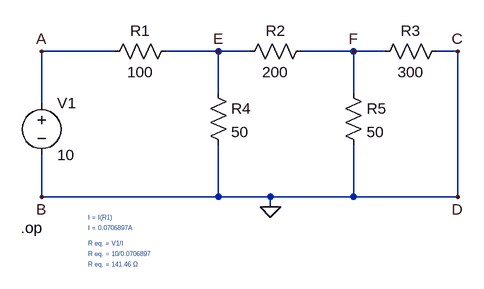
[diagram p0: schematic Eq_R_part1.asc]
Eq_R_part1.asc, the LTspice schematic file:
Version 4
SHEET 1 880 680
WIRE 96 32 -16 32
WIRE 256 32 176 32
WIRE 304 32 256 32
WIRE 464 32 384 32
WIRE 512 32 464 32
WIRE 624 32 592 32
WIRE 256 96 256 32
WIRE 464 96 464 32
WIRE -16 112 -16 32
WIRE -16 256 -16 192
WIRE 256 256 256 176
WIRE 256 256 -16 256
WIRE 336 256 256 256
WIRE 464 256 464 176
WIRE 464 256 336 256
WIRE 624 256 624 32
WIRE 624 256 464 256
WIRE 336 272 336 256
FLAG 336 272 0
FLAG -16 32 A
FLAG -16 256 B
FLAG 624 32 C
FLAG 624 256 D
FLAG 256 32 E
FLAG 464 32 F
SYMBOL voltage -16 96 R0
SYMATTR InstName V1
SYMATTR Value 10
SYMBOL res 80 48 R270
WINDOW 0 32 56 VTop 2
WINDOW 3 0 56 VBottom 2
SYMATTR InstName R1
SYMATTR Value 100
SYMBOL res 288 48 R270
WINDOW 0 32 56 VTop 2
WINDOW 3 0 56 VBottom 2
SYMATTR InstName R2
SYMATTR Value 200
SYMBOL res 496 48 R270
WINDOW 0 32 56 VTop 2
WINDOW 3 0 56 VBottom 2
SYMATTR InstName R3
SYMATTR Value 300
SYMBOL res 240 80 R0
SYMATTR InstName R4
SYMATTR Value 50
SYMBOL res 448 80 R0
SYMATTR InstName R5
SYMATTR Value 50
TEXT -48 304 Left 2 !.op
TEXT 56 288 Left 0 ;I = I(R1)
TEXT 56 304 Left 0 ;I = 0.0706897A
TEXT 56 328 Left 0 ;R eq. = V1/I
TEXT 56 344 Left 0 ;R eq. = 10/0.0706897
TEXT 56 360 Left 0 ;R eq. = 141.46 Ω

The netlist it stands for:
* Eq_R_part1.asc
V1 A 0 10
R1 A E 100
R2 E F 200
R3 F 0 300
R4 E 0 50
R5 F 0 50
.op
* I = I(R1)
* I = 0.0706897A
* R eq. = V1/I
* R eq. = 10/0.0706897
* R eq. = 141.46 Ω
.backanno
.end

* Results of the author's LTspice run, read from the files saved beside the schematic
* Operating Point:
*   V(a) = 10 V
*   V(e) = 2.931 V
*   V(f) = 517.2 mV
*   I(R5) = 10.34 mA
*   I(R4) = 58.62 mA
*   I(R3) = 1.724 mA
*   I(R2) = 12.07 mA
*   I(R1) = 70.69 mA
*   I(V1) = -70.69 mA